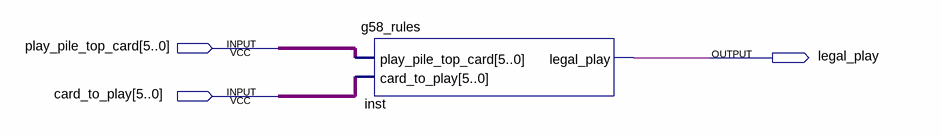
[diagram p0: schematic sheet]
// Quartus schematic g58_rules_test.bdf as structural Verilog: 1 symbols, 3 pins
module g58_rules_test (
  input  [5:0] play_pile_top_card,
  input  [5:0] card_to_play,
  output legal_play
);

  g58_rules inst (.play_pile_top_card(play_pile_top_card), .card_to_play(card_to_play), .legal_play(legal_play));
endmodule
